# Altium schematic sheet Teensy3_5.SchDoc
size A
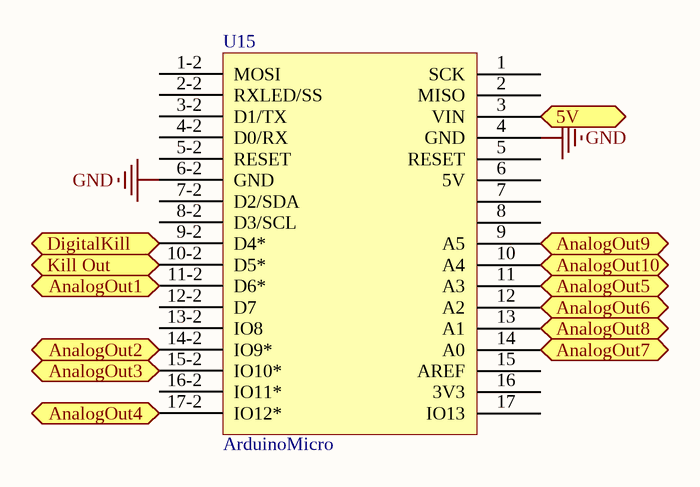
[diagram p0: Teensy3_5.SchDoc]

## Parts
U15  ArduinoMicro  [ArduinoMicro]

## Ports
5V (in), AnalogOut1 (in), AnalogOut2 (in), AnalogOut3 (in), AnalogOut4 (in), AnalogOut5 (in), AnalogOut6 (in), AnalogOut7 (in), AnalogOut8 (in), AnalogOut9 (in), AnalogOut10 (in), DigitalKill (out), Kill Out (in)

## Nets
GND: U15.4(GND) U15.6-2(GND)
5V: U15.3(VIN) ; port 5V
AnalogOut1: U15.11-2(D6*) ; port AnalogOut1
AnalogOut2: U15.14-2(IO9*) ; port AnalogOut2
AnalogOut3: U15.15-2(IO10*) ; port AnalogOut3
AnalogOut4: U15.17-2(IO12*) ; port AnalogOut4
AnalogOut5: U15.11(A3) ; port AnalogOut5
AnalogOut6: U15.12(A2) ; port AnalogOut6
AnalogOut7: U15.14(A0) ; port AnalogOut7
AnalogOut8: U15.13(A1) ; port AnalogOut8
AnalogOut9: U15.9(A5) ; port AnalogOut9
AnalogOut10: U15.10(A4) ; port AnalogOut10
DigitalKill: U15.9-2(D4*) ; port DigitalKill
Kill Out: U15.10-2(D5*) ; port Kill Out

Not connected (* = marked no-connect by the designer): U15 1(SCK) 1-2(MOSI) 2(MISO) 2-2(RXLED/SS) 3-2(D1/TX) 4-2(D0/RX) 5(RESET) 5-2(RESET) 6(5V) 7 7-2(D2/SDA) 8 8-2(D3/SCL) 12-2(D7) 13-2(IO8) 15(AREF) 16(3V3) 16-2(IO11*) 17(IO13)